# EAGLE schematic speedy_bldc (EAGLE 7.3.0)
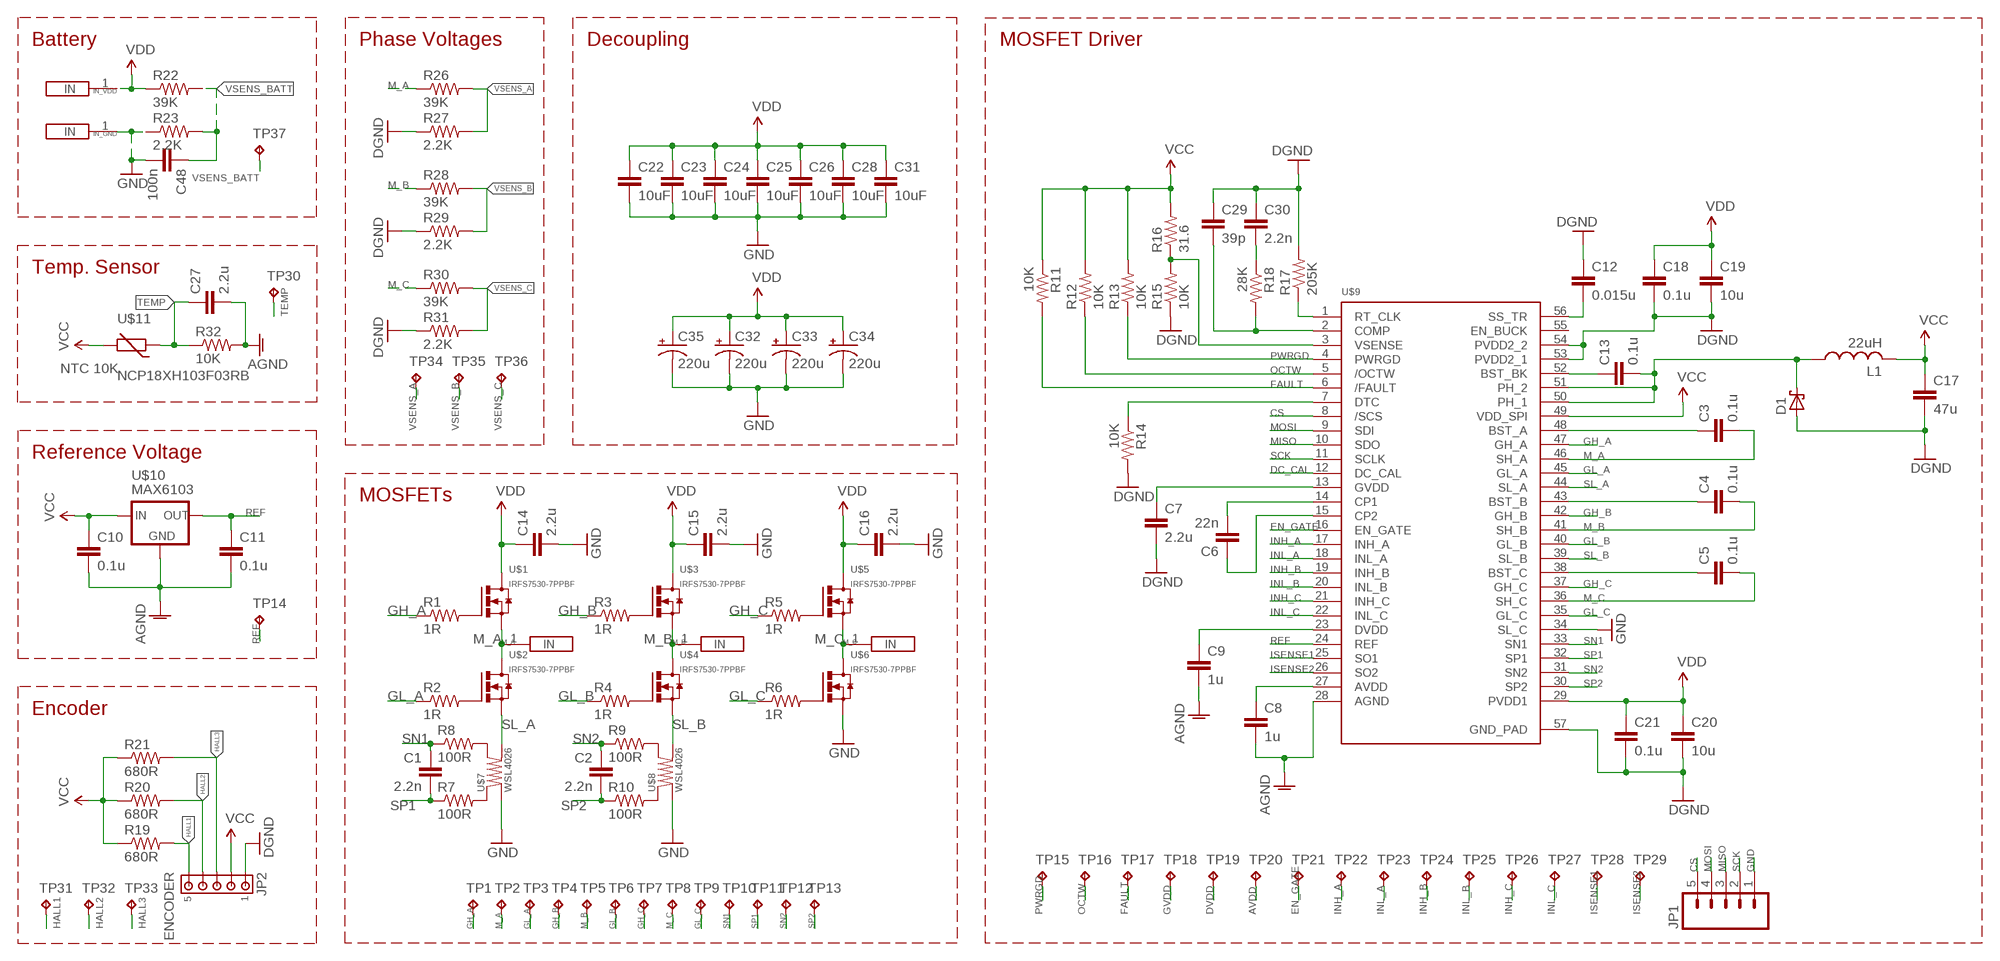
[diagram p0: schematic, sheet 1, part 1 of 2]
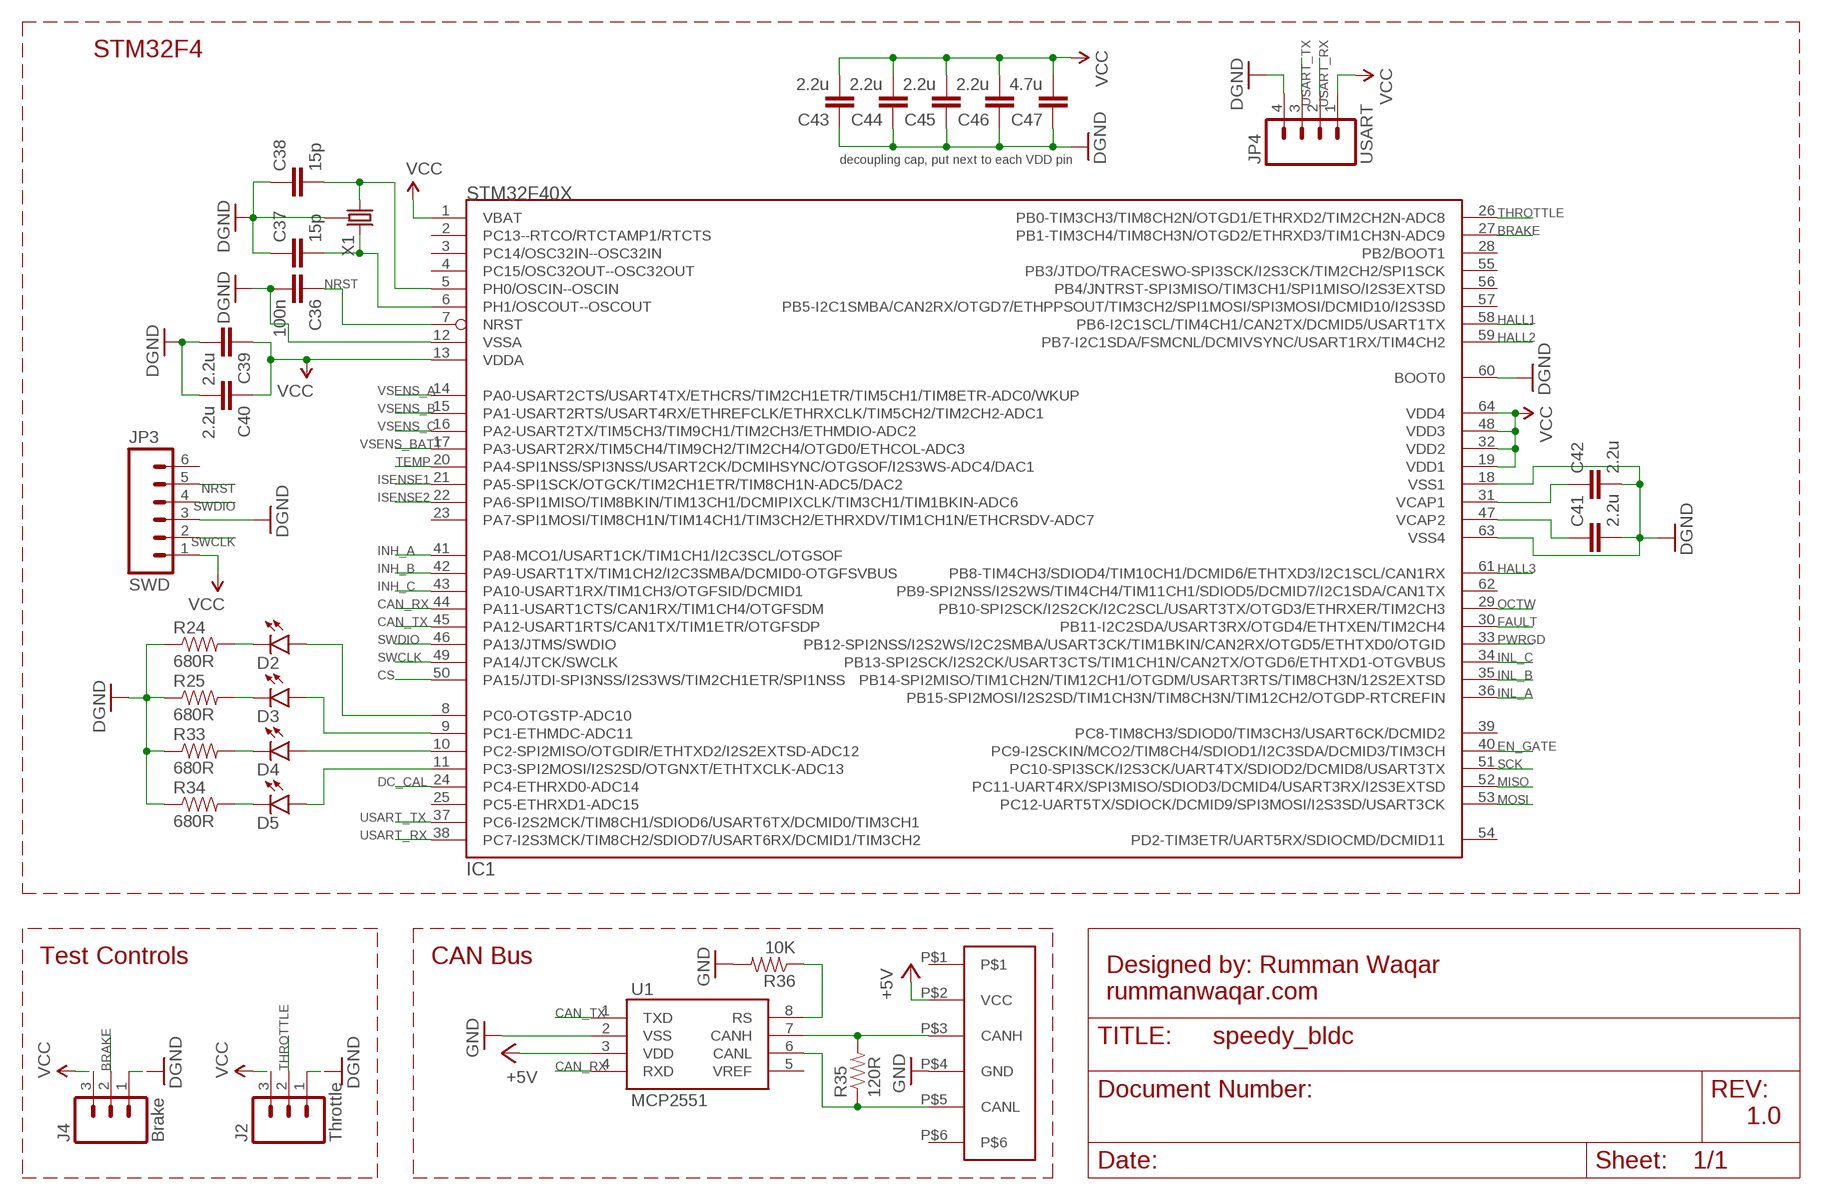
[diagram p1: schematic, sheet 1, part 2 of 2]

## Parts
C1  2.2n  CAP0603-CAP  [0603-CAP]
C2  2.2n  CAP0603-CAP  [0603-CAP]
C3  0.1u  CAP0603-CAP  [0603-CAP]
C4  0.1u  CAP0603-CAP  [0603-CAP]
C5  0.1u  CAP0603-CAP  [0603-CAP]
C6  22n  CAP0603-CAP  [0603-CAP]
C7  2.2u  CAP0805  [0805]
C8  1u  CAP0805  [0805]
C9  1u  CAP0603-CAP  [0603-CAP]
C10  0.1u  CAP0603-CAP  [0603-CAP]
C11  0.1u  CAP0603-CAP  [0603-CAP]
C12  0.015u  CAP0603-CAP  [0603-CAP]
C13  0.1u  CAP0603-CAP  [0603-CAP]
C14  2.2u  2.2UF50V10%(1206)  [1206-CAP]
C15  2.2u  2.2UF50V10%(1206)  [1206-CAP]
C16  2.2u  2.2UF50V10%(1206)  [1206-CAP]
C17  47u  CAP1206  [1206]
C18  0.1u  CAP0603-CAP  [0603-CAP]
C19  10u  CAP0805  [0805]
C20  10u  CAP0805  [0805]
C21  0.1u  CAP0603-CAP  [0603-CAP]
C22  10uF  CAP1206  [1206]
C23  10uF  CAP1206  [1206]
C24  10uF  CAP1206  [1206]
C25  10uF  CAP1206  [1206]
C26  10uF  CAP1206  [1206]
C27  2.2u  CAP0805  [0805]
C28  10uF  CAP1206  [1206]
C29  39p  CAP0603-CAP  [0603-CAP]
C30  2.2n  CAP0603-CAP  [0603-CAP]
C31  10uF  CAP1206  [1206]
C32  220u  CPOL-USE3.5-8  [E3,5-8]
C33  220u  CPOL-USE3.5-8  [E3,5-8]
C34  220u  CPOL-USE3.5-8  [E3,5-8]
C35  220u  CPOL-USE3.5-8  [E3,5-8]
C36  100n  CAP0603-CAP  [0603-CAP]
C37  15p  CAP0603-CAP  [0603-CAP]
C38  15p  CAP0603-CAP  [0603-CAP]
C39  2.2u  CAP0603-CAP  [0603-CAP]
C40  2.2u  CAP0603-CAP  [0603-CAP]
C41  2.2u  CAP0603-CAP  [0603-CAP]
C42  2.2u  CAP0603-CAP  [0603-CAP]
C43  2.2u  CAP0603-CAP  [0603-CAP]
C44  2.2u  CAP0603-CAP  [0603-CAP]
C45  2.2u  CAP0603-CAP  [0603-CAP]
C46  2.2u  CAP0603-CAP  [0603-CAP]
C47  4.7u  CAP0603-CAP  [0603-CAP]
C48  100n  CAP0603-CAP  [0603-CAP]
D1  SCHOTTKY-DIODESMC  [SMC]
D2  LED-FKIT-1206  [FKIT-LED-1206]
D3  LED-FKIT-1206  [FKIT-LED-1206]
D4  LED-FKIT-1206  [FKIT-LED-1206]
D5  LED-FKIT-1206  [FKIT-LED-1206]
IC1  STM32F40X  [LQFP64]
IN_GND  1CONN  [1CONN]
IN_VDD  1CONN  [1CONN]
J2  Throttle  M03PTH  [1X03]
J4  Brake  M03PTH  [1X03]
JP1  M05NO_SILK  [1X05_NO_SILK]
JP2  ENCODER  1445055-5  [1445055-5]
JP3  SWD  M06NO_SILK_FEMALE_PTH  [1X06_NO_SILK]
JP4  USART  M04PTH  [1X04]
L1  22uH  L-USL5650M  [L5650M]
M_A  1CONN  [1CONN]
M_B  1CONN  [1CONN]
M_C  1CONN  [1CONN]
R1  1R  RESISTOR0603  [0603-RES]
R2  1R  RESISTOR0603  [0603-RES]
R3  1R  RESISTOR0603  [0603-RES]
R4  1R  RESISTOR0603  [0603-RES]
R5  1R  RESISTOR0603  [0603-RES]
R6  1R  RESISTOR0603  [0603-RES]
R7  100R  RESISTOR0603  [0603-RES]
R8  100R  RESISTOR0603  [0603-RES]
R9  100R  RESISTOR0603  [0603-RES]
R10  100R  RESISTOR0603  [0603-RES]
R11  10K  RESISTOR0603  [0603-RES]
R12  10K  RESISTOR0603  [0603-RES]
R13  10K  RESISTOR0603  [0603-RES]
R14  10K  RESISTOR0603  [0603-RES]
R15  10K  RESISTOR0603  [0603-RES]
R16  31.6  RESISTOR0603  [0603-RES]
R17  205K  RESISTOR0603  [0603-RES]
R18  28K  RESISTOR0603  [0603-RES]
R19  680R  RESISTOR0603  [0603-RES]
R20  680R  RESISTOR0603  [0603-RES]
R21  680R  RESISTOR0603  [0603-RES]
R22  39K  RESISTOR0603-RES  [0603-RES]
R23  2.2K  RESISTOR0603-RES  [0603-RES]
R24  680R  RESISTOR0603  [0603-RES]
R25  680R  RESISTOR0603  [0603-RES]
R26  39K  RESISTOR0603-RES  [0603-RES]
R27  2.2K  RESISTOR0603-RES  [0603-RES]
R28  39K  RESISTOR0603-RES  [0603-RES]
R29  2.2K  RESISTOR0603-RES  [0603-RES]
R30  39K  RESISTOR0603-RES  [0603-RES]
R31  2.2K  RESISTOR0603-RES  [0603-RES]
R32  10K  RESISTOR0603  [0603-RES]
R33  680R  RESISTOR0603  [0603-RES]
R34  680R  RESISTOR0603  [0603-RES]
R35  120R  RESISTOR0603  [0603-RES]
R36  10K  RESISTOR0603  [0603-RES]
TP1  TPB1,27  [B1,27]
TP2  TPB1,27  [B1,27]
TP3  TPB1,27  [B1,27]
TP4  TPB1,27  [B1,27]
TP5  TPB1,27  [B1,27]
TP6  TPB1,27  [B1,27]
TP7  TPB1,27  [B1,27]
TP8  TPB1,27  [B1,27]
TP9  TPB1,27  [B1,27]
TP10  TPB1,27  [B1,27]
TP11  TPB1,27  [B1,27]
TP12  TPB1,27  [B1,27]
TP13  TPB1,27  [B1,27]
TP14  TPB1,27  [B1,27]
TP15  TPB1,27  [B1,27]
TP16  TPB1,27  [B1,27]
TP17  TPB1,27  [B1,27]
TP18  TPB1,27  [B1,27]
TP19  TPB1,27  [B1,27]
TP20  TPB1,27  [B1,27]
TP21  TPB1,27  [B1,27]
TP22  TPB1,27  [B1,27]
TP23  TPB1,27  [B1,27]
TP24  TPB1,27  [B1,27]
TP25  TPB1,27  [B1,27]
TP26  TPB1,27  [B1,27]
TP27  TPB1,27  [B1,27]
TP28  TPB1,27  [B1,27]
TP29  TPB1,27  [B1,27]
TP30  TPB1,27  [B1,27]
TP31  TPB1,27  [B1,27]
TP32  TPB1,27  [B1,27]
TP33  TPB1,27  [B1,27]
TP34  TPB1,27  [B1,27]
TP35  TPB1,27  [B1,27]
TP36  TPB1,27  [B1,27]
TP37  TPB1,27  [B1,27]
U1  MCP2551  [SO08]
U$1  IRFS7530-7PPBF  [D2PAK-7PIN]
U$2  IRFS7530-7PPBF  [D2PAK-7PIN]
U$3  IRFS7530-7PPBF  [D2PAK-7PIN]
U$4  IRFS7530-7PPBF  [D2PAK-7PIN]
U$5  IRFS7530-7PPBF  [D2PAK-7PIN]
U$6  IRFS7530-7PPBF  [D2PAK-7PIN]
U$7  WSL4026  [WSL4026]
U$8  WSL4026  [WSL4026]
U$9  DRV8301  [56-TSSOP-POWERPAD]
U$10  MAX6103  [SOT23-3]
U$11  NCP18XH103F03RB  [R0603]
U$12  CAN_6P6C  [CAN_6P6C]
X1  X1  CRYSTAL-GROUNDED  [CRYSTAL-SMD-5X3]

## Nets
+5V: U1.3(VDD) U$12.P$2(VCC)
AGND: C8.2 C9.2 C10.2 C11.2 C27.2 R32.2 U$9.28(AGND) U$10.3(GND)
AVDD: TP20.TP
BRAKE: IC1.27(PB1-TIM3CH4/TIM8CH3N/OTGD2/ETHRXD3/TIM1CH3N-ADC9) J4.2
CAN_RX: IC1.44(PA11-USART1CTS/CAN1RX/TIM1CH4/OTGFSDM) U1.4(RXD)
CAN_TX: IC1.45(PA12-USART1RTS/CAN1TX/TIM1ETR/OTGFSDP) U1.1(TXD)
CS: IC1.50(PA15/JTDI-SPI3NSS/I2S3WS/TIM2CH1ETR/SPI1NSS) JP1.5 U$9.8(/SCS)
DC_CAL: IC1.24(PC4-ETHRXD0-ADC14) U$9.12(DC_CAL)
DVDD: TP19.TP
EN_GATE: IC1.40(PC9-I2SCKIN/MCO2/TIM8CH4/SDIOD1/I2C3SDA/DCMID3/TIM3CH) TP21.TP U$9.16(EN_GATE)
FAULT: IC1.30(PB11-I2C2SDA/USART3RX/OTGD4/ETHTXEN/TIM2CH4) R11.2 TP17.TP U$9.6(/FAULT)
GH_A: R1.1 TP1.TP U$9.47(GH_A)
GH_B: R3.1 TP4.TP U$9.42(GH_B)
GH_C: R5.1 TP7.TP U$9.37(GH_C)
GL_A: R2.1 TP3.TP U$9.45(GL_A)
GL_B: R4.1 TP6.TP U$9.40(GL_B)
GL_C: R6.1 TP9.TP U$9.35(GL_C)
GND: C7.2 C12.1 C14.2 C15.2 C16.2 C17.2 C18.2 C19.2 C20.2 C21.2 C22.2 C23.2 C24.2 C25.2 C26.2 C28.2 C29.1 C30.1 C31.2 C32.- C33.- C34.- C35.- C37.1 C38.1 C39.2 C40.2 C43.1 C44.1 C45.1 C46.1 C47.1 C48.2 D1.A IC1.60(BOOT0) IN_GND.1(IN) J2.1 J4.1 JP1.1 JP2.1 JP3.3 JP4.4 R14.2 R15.1 R17.2 R23.1 R24.1 R25.1 R27.1 R29.1 R31.1 R33.1 R34.1 R36.2 U1.2(VSS) U$6.S U$6.S1(S) U$6.S2(S) U$6.S3(S) U$6.S4(S) U$7.P$2 U$8.P$2 U$9.34(SL_C) U$9.53(PVDD2_1) U$9.54(PVDD2_2) U$9.57(GND_PAD) U$12.P$4(GND) X1.2 X1.4 ; supply symbol labelled DGND
GVDD: TP18.TP
HALL1: IC1.58(PB6-I2C1SCL/TIM4CH1/CAN2TX/DCMID5/USART1TX) JP2.5 R19.2 TP31.TP
HALL2: IC1.59(PB7-I2C1SDA/FSMCNL/DCMIVSYNC/USART1RX/TIM4CH2) JP2.4 R20.2 TP32.TP
HALL3: IC1.61(PB8-TIM4CH3/SDIOD4/TIM10CH1/DCMID6/ETHTXD3/I2C1SCL/CAN1RX) JP2.3 R21.2 TP33.TP
INH_A: IC1.41(PA8-MCO1/USART1CK/TIM1CH1/I2C3SCL/OTGSOF) TP22.TP U$9.17(INH_A)
INH_B: IC1.42(PA9-USART1TX/TIM1CH2/I2C3SMBA/DCMID0-OTGFSVBUS) TP24.TP U$9.19(INH_B)
INH_C: IC1.43(PA10-USART1RX/TIM1CH3/OTGFSID/DCMID1) TP26.TP U$9.21(INH_C)
INL_A: IC1.36(PB15-SPI2MOSI/I2S2SD/TIM1CH3N/TIM8CH3N/TIM12CH2/OTGDP-RTCREFIN) TP23.TP U$9.18(INL_A)
INL_B: IC1.35(PB14-SPI2MISO/TIM1CH2N/TIM12CH1/OTGDM/USART3RTS/TIM8CH3N/12S2EXTSD) TP25.TP U$9.20(INL_B)
INL_C: IC1.34(PB13-SPI2SCK/I2S2CK/USART3CTS/TIM1CH1N/CAN2TX/OTGD6/ETHTXD1-OTGVBUS) TP27.TP U$9.22(INL_C)
ISENSE1: IC1.21(PA5-SPI1SCK/OTGCK/TIM2CH1ETR/TIM8CH1N-ADC5/DAC2) TP28.TP U$9.25(SO1)
ISENSE2: IC1.22(PA6-SPI1MISO/TIM8BKIN/TIM13CH1/DCMIPIXCLK/TIM3CH1/TIM1BKIN-ADC6) TP29.TP U$9.26(SO2)
M_A: C3.2 M_A.1(IN) R26.1 TP2.TP U$1.S U$1.S1(S) U$1.S2(S) U$1.S3(S) U$1.S4(S) U$2.D U$9.46(SH_A)
M_B: C4.2 M_B.1(IN) R28.1 TP5.TP U$3.S U$3.S1(S) U$3.S2(S) U$3.S3(S) U$3.S4(S) U$4.D U$9.41(SH_B)
M_C: C5.2 M_C.1(IN) R30.1 TP8.TP U$5.S U$5.S1(S) U$5.S2(S) U$5.S3(S) U$5.S4(S) U$6.D U$9.36(SH_C)
MISO: IC1.52(PC11-UART4RX/SPI3MISO/SDIOD3/DCMID4/USART3RX/I2S3EXTSD) JP1.3 U$9.10(SDO)
MOSI: IC1.53(PC12-UART5TX/SDIOCK/DCMID9/SPI3MOSI/I2S3SD/USART3CK) JP1.4 U$9.9(SDI)
N$1: R1.2 U$1.G
N$2: R2.2 U$2.G
N$3: R3.2 U$3.G
N$4: R4.2 U$4.G
N$5: R6.2 U$6.G
N$6: R5.2 U$5.G
N$7: R8.2 U$7.P$3
N$8: R7.2 U$7.P$4
N$9: R10.2 U$8.P$4
N$10: R9.2 U$8.P$3
N$11: C6.2 U$9.14(CP1)
N$12: C6.1 U$9.15(CP2)
N$13: C8.1 U$9.27(AVDD)
N$14: R15.2 R16.1 U$9.3(VSENSE)
N$15: C7.1 U$9.13(GVDD)
N$16: C9.1 U$9.23(DVDD)
N$17: R17.1 U$9.1(RT_CLK)
N$18: C12.2 U$9.56(SS_TR)
N$19: C13.2 D1.C L1.1 U$9.50(PH_1) U$9.51(PH_2)
N$20: C13.1 U$9.52(BST_BK)
N$21: R14.1 U$9.7(DTC)
N$22: C38.2 IC1.5(PH0/OSCIN--OSCIN) X1.3
N$23: C29.2 R18.2 U$9.2(COMP)
N$24: C37.2 IC1.6(PH1/OSCOUT--OSCOUT) X1.1
N$25: D2.C R24.2
N$26: C30.2 R18.1
N$27: D2.A IC1.8(PC0-OTGSTP-ADC10)
N$28: D3.C R25.2
N$29: D4.C R33.2
N$30: D5.C R34.2
N$31: R35.1 U1.6(CANL) U$12.P$5(CANL)
N$32: R35.2 U1.7(CANH) U$12.P$3(CANH)
N$33: R36.1 U1.8(RS)
N$40: D3.A IC1.9(PC1-ETHMDC-ADC11)
N$41: C3.1 U$9.48(BST_A)
N$42: D4.A IC1.10(PC2-SPI2MISO/OTGDIR/ETHTXD2/I2S2EXTSD-ADC12)
N$43: C4.1 U$9.43(BST_B)
N$44: D5.A IC1.11(PC3-SPI2MOSI/I2S2SD/OTGNXT/ETHTXCLK-ADC13)
N$45: C5.1 U$9.38(BST_C)
NRST: C36.1 IC1.7(NRST) JP3.5
OCTW: IC1.29(PB10-SPI2SCK/I2S2CK/I2C2SCL/USART3TX/OTGD3/ETHRXER/TIM2CH3) R12.1 TP16.TP U$9.5(/OCTW)
PWRGD: IC1.33(PB12-SPI2NSS/I2S2WS/I2C2SMBA/USART3CK/TIM1BKIN/CAN2RX/OTGD5/ETHTXD0/OTGID) R13.1 TP15.TP U$9.4(PWRGD)
REF: C11.1 TP14.TP U$9.24(REF) U$10.2(OUT)
SCK: IC1.51(PC10-SPI3SCK/I2S3CK/UART4TX/SDIOD2/DCMID8/USART3TX) JP1.2 U$9.11(SCLK)
SL_A: U$2.S U$2.S1(S) U$2.S2(S) U$2.S3(S) U$2.S4(S) U$7.P$1 U$9.44(SL_A)
SL_B: U$4.S U$4.S1(S) U$4.S2(S) U$4.S3(S) U$4.S4(S) U$8.P$1 U$9.39(SL_B)
SN1: C1.1 R8.1 TP10.TP U$9.33(SN1)
SN2: C2.1 R9.1 TP12.TP U$9.31(SN2)
SP1: C1.2 R7.1 TP11.TP U$9.32(SP1)
SP2: C2.2 R10.1 TP13.TP U$9.30(SP2)
SWCLK: IC1.49(PA14/JTCK/SWCLK) JP3.2
SWDIO: IC1.46(PA13/JTMS/SWDIO) JP3.4
TEMP: C27.1 IC1.20(PA4-SPI1NSS/SPI3NSS/USART2CK/DCMIHSYNC/OTGSOF/I2S3WS-ADC4/DAC1) R32.1 TP30.TP U$11.1
THROTTLE: IC1.26(PB0-TIM3CH3/TIM8CH2N/OTGD1/ETHRXD2/TIM2CH2N-ADC8) J2.2
USART_RX: IC1.38(PC7-I2S3MCK/TIM8CH2/SDIOD7/USART6RX/DCMID1/TIM3CH2) JP4.2
USART_TX: IC1.37(PC6-I2S2MCK/TIM8CH1/SDIOD6/USART6TX/DCMID0/TIM3CH1) JP4.3
VCAP1: C42.1 IC1.31(VCAP1)
VCAP2: C41.1 IC1.47(VCAP2)
VCC: C10.1 C17.1 C39.1 C40.1 C43.2 C44.2 C45.2 C46.2 C47.2 IC1.1(VBAT) IC1.13(VDDA) IC1.19(VDD1) IC1.32(VDD2) IC1.48(VDD3) IC1.64(VDD4) J2.3 J4.3 JP2.2 JP3.1 JP4.1 L1.2 R11.1 R12.2 R13.2 R16.2 R19.1 R20.1 R21.1 U$9.49(VDD_SPI) U$10.1(IN) U$11.2
VDD: C14.1 C15.1 C16.1 C18.1 C19.1 C20.1 C21.1 C22.1 C23.1 C24.1 C25.1 C26.1 C28.1 C31.1 C32.+ C33.+ C34.+ C35.+ IN_VDD.1(IN) R22.1 U$1.D U$3.D U$5.D U$9.29(PVDD1)
VSENS_A: IC1.14(PA0-USART2CTS/USART4TX/ETHCRS/TIM2CH1ETR/TIM5CH1/TIM8ETR-ADC0/WKUP) R26.2 R27.2 TP34.TP
VSENS_B: IC1.15(PA1-USART2RTS/USART4RX/ETHREFCLK/ETHRXCLK/TIM5CH2/TIM2CH2-ADC1) R28.2 R29.2 TP35.TP
VSENS_BATT: C48.1 IC1.17(PA3-USART2RX/TIM5CH4/TIM9CH2/TIM2CH4/OTGD0/ETHCOL-ADC3) R22.2 R23.2 TP37.TP
VSENS_C: IC1.16(PA2-USART2TX/TIM5CH3/TIM9CH1/TIM2CH3/ETHMDIO-ADC2) R30.2 R31.2 TP36.TP
VSS1: C41.2 C42.2 IC1.18(VSS1) IC1.63(VSS4) ; supply symbol labelled DGND
VSSA: C36.2 IC1.12(VSSA) ; supply symbol labelled DGND
Unconnected: IC1.2(PC13--RTCO/RTCTAMP1/RTCTS) IC1.3(PC14/OSC32IN--OSC32IN) IC1.4(PC15/OSC32OUT--OSC32OUT) IC1.23(PA7-SPI1MOSI/TIM8CH1N/TIM14CH1/TIM3CH2/ETHRXDV/TIM1CH1N/ETHCRSDV-ADC7) IC1.25(PC5-ETHRXD1-ADC15) IC1.28(PB2/BOOT1) IC1.39(PC8-TIM8CH3/SDIOD0/TIM3CH3/USART6CK/DCMID2) IC1.54(PD2-TIM3ETR/UART5RX/SDIOCMD/DCMID11) IC1.55(PB3/JTDO/TRACESWO-SPI3SCK/I2S3CK/TIM2CH2/SPI1SCK) IC1.56(PB4/JNTRST-SPI3MISO/TIM3CH1/SPI1MISO/I2S3EXTSD) IC1.57(PB5-I2C1SMBA/CAN2RX/OTGD7/ETHPPSOUT/TIM3CH2/SPI1MOSI/SPI3MOSI/DCMID10/I2S3SD) IC1.62(PB9-SPI2NSS/I2S2WS/TIM4CH4/TIM11CH1/SDIOD5/DCMID7/I2C1SDA/CAN1TX) JP3.6 U1.5(VREF) U$9.55(EN_BUCK) U$12.P$1 U$12.P$6

## Notes on the sheet
- Battery | Phase Voltages | Decoupling | MOSFET Driver | STM32F4
- decoupling cap, put next to each VDD pin
- Temp. Sensor
- NTC 10K
- Reference Voltage
- MOSFETs
- Encoder
- Test Controls | CAN Bus
- Designed by: Rumman Waqar
  rummanwaqar.com
- 1.0

## Library data of the parts
C1 C2 C10-C13 C18-C31 C36-C48 = SparkFun-Capacitors:CAP: Capacitor Standard 0603 ceramic capacitor, and 0.1" leaded capacitor.
C3-C5 C7 = SparkFun-Capacitors:CAP: Capacitor Standard 0603 ceramic capacitor, and 0.1" leaded capacitor.; VOLTAGE: 16V
C6 = SparkFun-Capacitors:CAP: Capacitor Standard 0603 ceramic capacitor, and 0.1" leaded capacitor.; VOLTAGE: 60V
C8 = SparkFun-Capacitors:CAP: Capacitor Standard 0603 ceramic capacitor, and 0.1" leaded capacitor.; VOLTAGE: 10V
C9 = SparkFun-Capacitors:CAP: Capacitor Standard 0603 ceramic capacitor, and 0.1" leaded capacitor.; VOLTAGE: 6.3V
C14-C16 = SparkFun-Capacitors:2.2UF50V10%(1206): CAP-10009
C17 = SparkFun-Capacitors:CAP: Capacitor Standard 0603 ceramic capacitor, and 0.1" leaded capacitor.; DIGIKEY: 490-3907-1-ND
C32-C35 = rcl:CPOL-US: POLARIZED CAPACITOR, American symbol
D1 = diode:SCHOTTKY-DIODE: Schottky Diode; DIGIKEY: VS-30BQ100-M3/9AT-ND
D2-D5 = SparkFun-LED:LED: LEDs Standard schematic elements and footprints for 5mm, 3mm, 1206, and 0603 sized LEDs. 5mm - Spark Fun Electronics SKU : COM-00529 (and others)
IC1 = pel_stm32:STM32F40X; DIGIKEY: 497-11767-ND
IN_GND IN_VDD M_A M_B M_C = speedy_bldc:1CONN
J2 J4 = SparkFun-Connectors:M03: Header 3 Standard 3-pin 0.1" header. Use with straight break away headers (SKU : PRT-00116), right angle break away headers (PRT-00553), swiss pins (PRT-00743), machine pins (PRT-00117), and female headers (PRT-00115). Molex polarized connector foot print use with SKU : PRT-08232 with associated crimp pins and housings.
JP1 = SparkFun-Connectors:M05: Header 5 Standard 5-pin 0.1" header. Use with straight break away headers (SKU : PRT-00116), right angle break away headers (PRT-00553), swiss pins (PRT-00743), machine pins (PRT-00117), and female headers (PRT-00115). Molex polarized connector foot print use with SKU : PRT-08230 with associated crimp pins and housings.
JP2 = con-amp:1445055-5: Micro MATE-N-LOK Connectors grid 1.5 mm Source: ENG_CD_1445055_A.pdf
JP3 = SparkFun-Connectors:M06: Header 6 Standard 6-pin 0.1" header. Use with straight break away headers (SKU : PRT-00116), right angle break away headers (PRT-00553), swiss pins (PRT-00743), machine pins (PRT-00117), and female headers (PRT-00115). Molex polarized connector foot print use with SKU : PRT-08094 with associated crimp pins and housings. NOTES ON THE VARIANTS LOCK and LOCK_LONGPADS... This footprint was designed to help hold the alignment of a through-hole component (i.e. 6-pin header) while soldering it into place. You may notice that each hole has been shifted either up or down by 0.005 of an inch from it's more standard position (which is a perfectly straight line). This slight alteration caused the pins (the squares in the middle) to touch the edges of the holes. Because they are alternating, it causes a "brace" to hold the component in place. 0.005 has proven to be the perfect amount of "off-center" position when using our standard breakaway headers. Although looks a little odd when you look at the bare footprint, once you have a header in there, the alteration is very hard to notice. Also,if you push a header all the way into place, it is covered up entirely on the bottom side. This idea of altering the position of holes to aid alignment will be further integrated into the Sparkfun Library for other footprints. It can help hold any component with 3 or more connection pins.; PROD_ID: CONN-08437
JP4 = SparkFun-Connectors:M04: Header 4 Standard 4-pin 0.1" header. Use with straight break away headers (SKU : PRT-00116), right angle break away headers (PRT-00553), swiss pins (PRT-00743), machine pins (PRT-00117), and female headers (PRT-00115). Molex polarized connector foot print use with SKU : PRT-08231 with associated crimp pins and housings. 1MM SMD Version SKU: PRT-10208
L1 = rcl:L-US: INDUCTOR, American symbol; DIGIKEY: 490-5272-1-ND
R1-R36 = SparkFun-Resistors:RESISTOR: Resistor Basic schematic elements and footprints for 0603, 1206, and PTH resistors.
TP1-TP37 = testpad:TP: Test pad
U1 = SparkFun-DigitalIC:MCP2551: CAN transceiver; PROD_ID: IC-09907
U$1-U$6 = speedy_bldc:IRFS7530-7PPBF: IRFS7530-7PPbF HEXFET Power MOSFET
U$7 U$8 = speedy_bldc:WSL4026
U$9 = speedy_bldc:DRV8301: DRV8301 Three-Phase Gate Driver with Dual Current Shunt Amplifiers and Buck Regulator
U$10 = speedy_bldc:MAX6103: MAX6103 3V voltage reference
U$11 = bldc_lib:NCP18XH103F03RB: NTC Thermistor NTC Thermistors 10K OHM 1%
U$12 = Shell2015:CAN_6P6C: Digikey part: 553-2258-ND
X1 = SparkFun-FreqCtrl:CRYSTAL-GROUNDED; DIGIKEY: 535-9721-2-ND